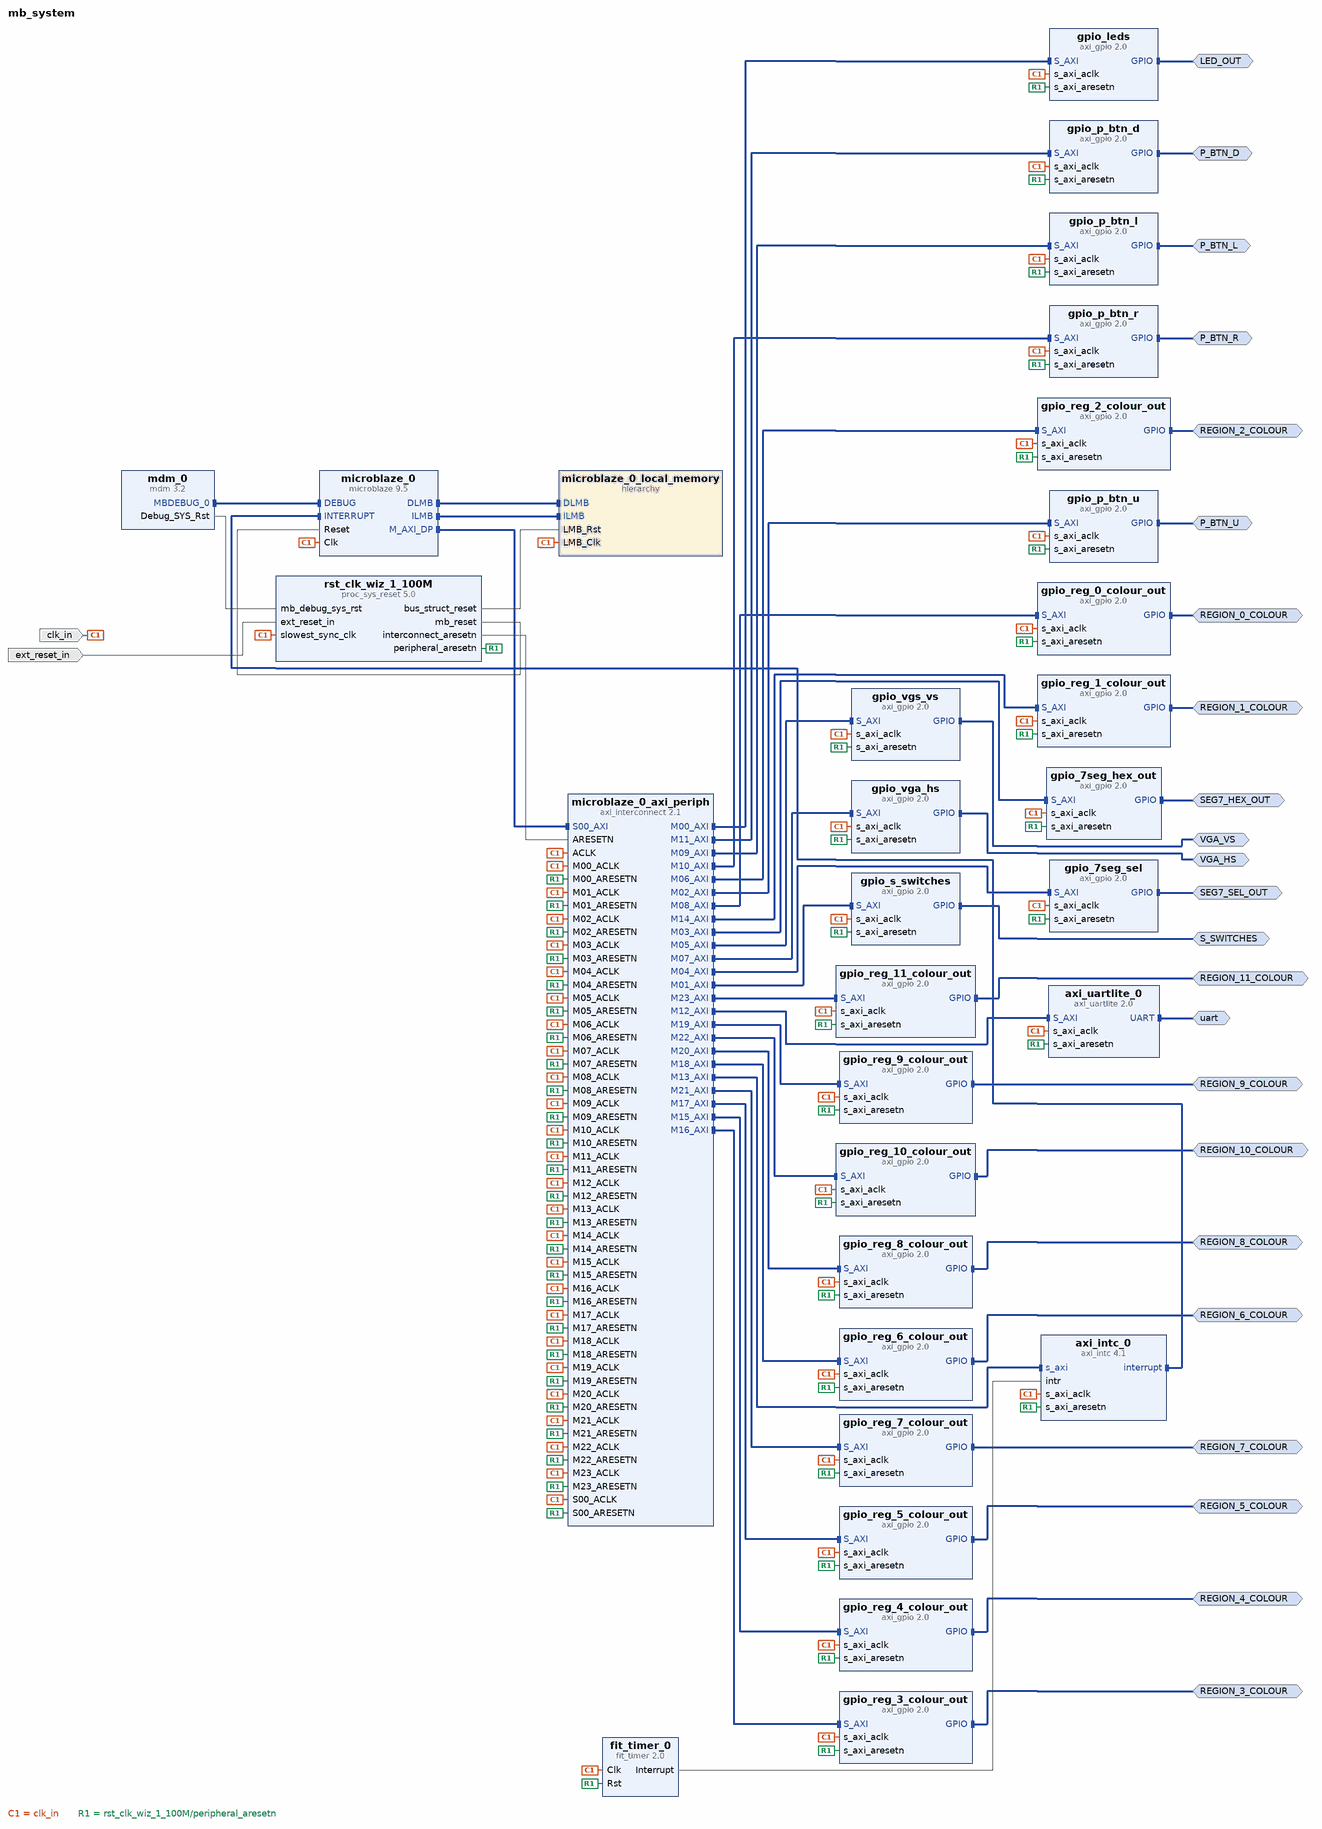
[diagram p0: block diagram of the top level]
# Vivado block design mb_system, Vivado 2015.2
create_bd_design mb_system

create_bd_intf_port -mode Master -vlnv xilinx.com:interface:gpio_rtl:1.0 LED_OUT
create_bd_intf_port -mode Master -vlnv xilinx.com:interface:gpio_rtl:1.0 S_SWITCHES
create_bd_intf_port -mode Master -vlnv xilinx.com:interface:gpio_rtl:1.0 P_BTN_U
create_bd_intf_port -mode Master -vlnv xilinx.com:interface:gpio_rtl:1.0 SEG7_HEX_OUT
create_bd_intf_port -mode Master -vlnv xilinx.com:interface:gpio_rtl:1.0 SEG7_SEL_OUT
create_bd_intf_port -mode Master -vlnv xilinx.com:interface:gpio_rtl:1.0 VGA_VS
create_bd_intf_port -mode Master -vlnv xilinx.com:interface:gpio_rtl:1.0 REGION_2_COLOUR
create_bd_intf_port -mode Master -vlnv xilinx.com:interface:gpio_rtl:1.0 VGA_HS
create_bd_intf_port -mode Master -vlnv xilinx.com:interface:gpio_rtl:1.0 REGION_0_COLOUR
create_bd_intf_port -mode Master -vlnv xilinx.com:interface:gpio_rtl:1.0 P_BTN_L
create_bd_intf_port -mode Master -vlnv xilinx.com:interface:gpio_rtl:1.0 P_BTN_R
create_bd_intf_port -mode Master -vlnv xilinx.com:interface:gpio_rtl:1.0 P_BTN_D
create_bd_intf_port -mode Master -vlnv xilinx.com:interface:uart_rtl:1.0 uart
create_bd_intf_port -mode Master -vlnv xilinx.com:interface:gpio_rtl:1.0 REGION_1_COLOUR
create_bd_intf_port -mode Master -vlnv xilinx.com:interface:gpio_rtl:1.0 REGION_3_COLOUR
create_bd_intf_port -mode Master -vlnv xilinx.com:interface:gpio_rtl:1.0 REGION_4_COLOUR
create_bd_intf_port -mode Master -vlnv xilinx.com:interface:gpio_rtl:1.0 REGION_5_COLOUR
create_bd_intf_port -mode Master -vlnv xilinx.com:interface:gpio_rtl:1.0 REGION_6_COLOUR
create_bd_intf_port -mode Master -vlnv xilinx.com:interface:gpio_rtl:1.0 REGION_9_COLOUR
create_bd_intf_port -mode Master -vlnv xilinx.com:interface:gpio_rtl:1.0 REGION_8_COLOUR
create_bd_intf_port -mode Master -vlnv xilinx.com:interface:gpio_rtl:1.0 REGION_7_COLOUR
create_bd_intf_port -mode Master -vlnv xilinx.com:interface:gpio_rtl:1.0 REGION_10_COLOUR
create_bd_intf_port -mode Master -vlnv xilinx.com:interface:gpio_rtl:1.0 REGION_11_COLOUR
create_bd_port -dir I -type clk clk_in
set_property -dict {CONFIG.FREQ_HZ 100000000 CONFIG.PHASE 0.000} [get_bd_ports clk_in]
create_bd_port -dir I -type rst ext_reset_in

create_bd_cell -type hier microblaze_0_local_memory
create_bd_cell -type ip -vlnv xilinx.com:ip:axi_gpio:2.0 gpio_leds
set_property -dict {CONFIG.C_GPIO_WIDTH 16 CONFIG.C_ALL_OUTPUTS 1} [get_bd_cells gpio_leds]
create_bd_cell -type ip -vlnv xilinx.com:ip:axi_intc:4.1 axi_intc_0
create_bd_cell -type ip -vlnv xilinx.com:ip:axi_uartlite:2.0 axi_uartlite_0
create_bd_cell -type ip -vlnv xilinx.com:ip:fit_timer:2.0 fit_timer_0
set_property -dict {CONFIG.C_NO_CLOCKS 400000} [get_bd_cells fit_timer_0]
create_bd_cell -type ip -vlnv xilinx.com:ip:axi_gpio:2.0 gpio_7seg_sel
set_property -dict {CONFIG.C_GPIO_WIDTH 4 CONFIG.C_DOUT_DEFAULT 0xFFFFFFFF CONFIG.C_ALL_OUTPUTS 1} [get_bd_cells gpio_7seg_sel]
create_bd_cell -type ip -vlnv xilinx.com:ip:axi_gpio:2.0 gpio_s_switches
set_property -dict {CONFIG.C_GPIO_WIDTH 16 CONFIG.C_ALL_INPUTS 1} [get_bd_cells gpio_s_switches]
create_bd_cell -type ip -vlnv xilinx.com:ip:axi_gpio:2.0 gpio_7seg_hex_out
set_property -dict {CONFIG.C_GPIO_WIDTH 8 CONFIG.C_ALL_OUTPUTS 1} [get_bd_cells gpio_7seg_hex_out]
create_bd_cell -type ip -vlnv xilinx.com:ip:axi_gpio:2.0 gpio_p_btn_l
set_property -dict {CONFIG.C_GPIO_WIDTH 1 CONFIG.C_ALL_INPUTS 1} [get_bd_cells gpio_p_btn_l]
create_bd_cell -type ip -vlnv xilinx.com:ip:axi_gpio:2.0 gpio_p_btn_r
set_property -dict {CONFIG.C_GPIO_WIDTH 1 CONFIG.C_ALL_INPUTS 1} [get_bd_cells gpio_p_btn_r]
create_bd_cell -type ip -vlnv xilinx.com:ip:axi_gpio:2.0 gpio_p_btn_d
set_property -dict {CONFIG.C_GPIO_WIDTH 1 CONFIG.C_ALL_INPUTS 1} [get_bd_cells gpio_p_btn_d]
create_bd_cell -type ip -vlnv xilinx.com:ip:axi_gpio:2.0 gpio_p_btn_u
set_property -dict {CONFIG.C_GPIO_WIDTH 1 CONFIG.C_ALL_INPUTS 1} [get_bd_cells gpio_p_btn_u]
create_bd_cell -type ip -vlnv xilinx.com:ip:axi_gpio:2.0 gpio_vgs_vs
set_property -dict {CONFIG.C_GPIO_WIDTH 1 CONFIG.C_ALL_INPUTS 0 CONFIG.C_ALL_OUTPUTS 1} [get_bd_cells gpio_vgs_vs]
create_bd_cell -type ip -vlnv xilinx.com:ip:axi_gpio:2.0 gpio_reg_2_colour_out
set_property -dict [list \
  CONFIG.C_GPIO_WIDTH 12 \
  CONFIG.C_ALL_INPUTS 0 \
  CONFIG.C_DOUT_DEFAULT 0xFFFFFFFF \
  CONFIG.C_ALL_OUTPUTS 1 \
] [get_bd_cells gpio_reg_2_colour_out]
create_bd_cell -type ip -vlnv xilinx.com:ip:axi_gpio:2.0 gpio_vga_hs
set_property -dict {CONFIG.C_GPIO_WIDTH 1 CONFIG.C_ALL_INPUTS 0 CONFIG.C_ALL_OUTPUTS 1} [get_bd_cells gpio_vga_hs]
create_bd_cell -type ip -vlnv xilinx.com:ip:axi_gpio:2.0 gpio_reg_0_colour_out
set_property -dict [list \
  CONFIG.C_GPIO_WIDTH 12 \
  CONFIG.C_ALL_INPUTS 0 \
  CONFIG.C_DOUT_DEFAULT 0xFFFFFFFF \
  CONFIG.C_ALL_OUTPUTS 1 \
] [get_bd_cells gpio_reg_0_colour_out]
create_bd_cell -type ip -vlnv xilinx.com:ip:mdm:3.2 mdm_0
create_bd_cell -type ip -vlnv xilinx.com:ip:microblaze:9.5 microblaze_0
set_property -dict [list \
  CONFIG.C_D_AXI 1 \
  CONFIG.C_D_LMB 1 \
  CONFIG.C_I_LMB 1 \
  CONFIG.C_DEBUG_ENABLED 1 \
  CONFIG.C_USE_ICACHE 0 \
  CONFIG.C_USE_DCACHE 0 \
] [get_bd_cells microblaze_0]
create_bd_cell -type ip -vlnv xilinx.com:ip:axi_interconnect:2.1 microblaze_0_axi_periph
set_property -dict {CONFIG.NUM_MI 24} [get_bd_cells microblaze_0_axi_periph]
create_bd_cell -type ip -vlnv xilinx.com:ip:proc_sys_reset:5.0 rst_clk_wiz_1_100M
create_bd_cell -type ip -vlnv xilinx.com:ip:axi_gpio:2.0 gpio_reg_1_colour_out
set_property -dict [list \
  CONFIG.C_GPIO_WIDTH 12 \
  CONFIG.C_ALL_INPUTS 0 \
  CONFIG.C_DOUT_DEFAULT 0xFFFFFFFF \
  CONFIG.C_ALL_OUTPUTS 1 \
] [get_bd_cells gpio_reg_1_colour_out]
create_bd_cell -type ip -vlnv xilinx.com:ip:axi_gpio:2.0 gpio_reg_4_colour_out
set_property -dict [list \
  CONFIG.C_GPIO_WIDTH 12 \
  CONFIG.C_ALL_INPUTS 0 \
  CONFIG.C_DOUT_DEFAULT 0xFFFFFFFF \
  CONFIG.C_ALL_OUTPUTS 1 \
] [get_bd_cells gpio_reg_4_colour_out]
create_bd_cell -type ip -vlnv xilinx.com:ip:axi_gpio:2.0 gpio_reg_3_colour_out
set_property -dict [list \
  CONFIG.C_GPIO_WIDTH 12 \
  CONFIG.C_ALL_INPUTS 0 \
  CONFIG.C_DOUT_DEFAULT 0xFFFFFFFF \
  CONFIG.C_ALL_OUTPUTS 1 \
] [get_bd_cells gpio_reg_3_colour_out]
create_bd_cell -type ip -vlnv xilinx.com:ip:axi_gpio:2.0 gpio_reg_5_colour_out
set_property -dict [list \
  CONFIG.C_GPIO_WIDTH 12 \
  CONFIG.C_ALL_INPUTS 0 \
  CONFIG.C_DOUT_DEFAULT 0xFFFFFFFF \
  CONFIG.C_ALL_OUTPUTS 1 \
] [get_bd_cells gpio_reg_5_colour_out]
create_bd_cell -type ip -vlnv xilinx.com:ip:axi_gpio:2.0 gpio_reg_6_colour_out
set_property -dict [list \
  CONFIG.C_GPIO_WIDTH 12 \
  CONFIG.C_ALL_INPUTS 0 \
  CONFIG.C_DOUT_DEFAULT 0xFFFFFFFF \
  CONFIG.C_ALL_OUTPUTS 1 \
] [get_bd_cells gpio_reg_6_colour_out]
create_bd_cell -type ip -vlnv xilinx.com:ip:axi_gpio:2.0 gpio_reg_9_colour_out
set_property -dict [list \
  CONFIG.C_GPIO_WIDTH 12 \
  CONFIG.C_ALL_INPUTS 0 \
  CONFIG.C_DOUT_DEFAULT 0xFFFFFFFF \
  CONFIG.C_ALL_OUTPUTS 1 \
] [get_bd_cells gpio_reg_9_colour_out]
create_bd_cell -type ip -vlnv xilinx.com:ip:axi_gpio:2.0 gpio_reg_8_colour_out
set_property -dict [list \
  CONFIG.C_GPIO_WIDTH 12 \
  CONFIG.C_ALL_INPUTS 0 \
  CONFIG.C_DOUT_DEFAULT 0xFFFFFFFF \
  CONFIG.C_ALL_OUTPUTS 1 \
] [get_bd_cells gpio_reg_8_colour_out]
create_bd_cell -type ip -vlnv xilinx.com:ip:axi_gpio:2.0 gpio_reg_7_colour_out
set_property -dict [list \
  CONFIG.C_GPIO_WIDTH 12 \
  CONFIG.C_ALL_INPUTS 0 \
  CONFIG.C_DOUT_DEFAULT 0xFFFFFFFF \
  CONFIG.C_ALL_OUTPUTS 1 \
] [get_bd_cells gpio_reg_7_colour_out]
create_bd_cell -type ip -vlnv xilinx.com:ip:axi_gpio:2.0 gpio_reg_10_colour_out
set_property -dict [list \
  CONFIG.C_GPIO_WIDTH 12 \
  CONFIG.C_ALL_INPUTS 0 \
  CONFIG.C_DOUT_DEFAULT 0xFFFFFFFF \
  CONFIG.C_ALL_OUTPUTS 1 \
] [get_bd_cells gpio_reg_10_colour_out]
create_bd_cell -type ip -vlnv xilinx.com:ip:axi_gpio:2.0 gpio_reg_11_colour_out
set_property -dict [list \
  CONFIG.C_GPIO_WIDTH 12 \
  CONFIG.C_ALL_INPUTS 0 \
  CONFIG.C_DOUT_DEFAULT 0xFFFFFFFF \
  CONFIG.C_ALL_OUTPUTS 1 \
] [get_bd_cells gpio_reg_11_colour_out]

# ---- hierarchy /microblaze_0_local_memory ----
current_bd_instance /microblaze_0_local_memory
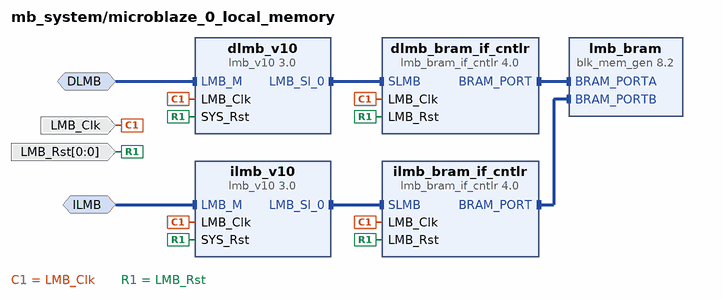
[diagram p1: block diagram inside /microblaze_0_local_memory]
create_bd_intf_pin -mode MirroredMaster -vlnv xilinx.com:interface:lmb_rtl:1.0 DLMB
create_bd_intf_pin -mode MirroredMaster -vlnv xilinx.com:interface:lmb_rtl:1.0 ILMB
create_bd_pin -dir I -type clk LMB_Clk
create_bd_pin -dir I -from 0 -to 0 -type rst LMB_Rst

create_bd_cell -type ip -vlnv xilinx.com:ip:lmb_bram_if_cntlr:4.0 dlmb_bram_if_cntlr
set_property -dict {CONFIG.C_ECC 0} [get_bd_cells dlmb_bram_if_cntlr]
create_bd_cell -type ip -vlnv xilinx.com:ip:lmb_v10:3.0 dlmb_v10
create_bd_cell -type ip -vlnv xilinx.com:ip:lmb_bram_if_cntlr:4.0 ilmb_bram_if_cntlr
set_property -dict {CONFIG.C_ECC 0} [get_bd_cells ilmb_bram_if_cntlr]
create_bd_cell -type ip -vlnv xilinx.com:ip:lmb_v10:3.0 ilmb_v10
create_bd_cell -type ip -vlnv xilinx.com:ip:blk_mem_gen:8.2 lmb_bram
set_property -dict {CONFIG.Memory_Type True_Dual_Port_RAM CONFIG.use_bram_block BRAM_Controller} [get_bd_cells lmb_bram]

# ---- connections ----

current_bd_instance /microblaze_0_local_memory
connect_bd_intf_net -intf_net microblaze_0_dlmb_bus [get_bd_intf_pins dlmb_v10/LMB_Sl_0] [get_bd_intf_pins dlmb_bram_if_cntlr/SLMB]
connect_bd_intf_net -intf_net microblaze_0_ilmb_bus [get_bd_intf_pins ilmb_v10/LMB_Sl_0] [get_bd_intf_pins ilmb_bram_if_cntlr/SLMB]
connect_bd_intf_net -intf_net microblaze_0_dlmb_cntlr [get_bd_intf_pins dlmb_bram_if_cntlr/BRAM_PORT] [get_bd_intf_pins lmb_bram/BRAM_PORTA]
connect_bd_intf_net -intf_net microblaze_0_ilmb_cntlr [get_bd_intf_pins ilmb_bram_if_cntlr/BRAM_PORT] [get_bd_intf_pins lmb_bram/BRAM_PORTB]
connect_bd_intf_net -intf_net microblaze_0_dlmb [get_bd_intf_pins DLMB] [get_bd_intf_pins dlmb_v10/LMB_M]
connect_bd_intf_net -intf_net microblaze_0_ilmb [get_bd_intf_pins ILMB] [get_bd_intf_pins ilmb_v10/LMB_M]
connect_bd_net -net microblaze_0_Clk [get_bd_pins LMB_Clk] \
  [get_bd_pins dlmb_bram_if_cntlr/LMB_Clk] [get_bd_pins dlmb_v10/LMB_Clk] [get_bd_pins ilmb_bram_if_cntlr/LMB_Clk] \
  [get_bd_pins ilmb_v10/LMB_Clk]
connect_bd_net -net microblaze_0_LMB_Rst [get_bd_pins LMB_Rst] \
  [get_bd_pins dlmb_bram_if_cntlr/LMB_Rst] [get_bd_pins dlmb_v10/SYS_Rst] [get_bd_pins ilmb_bram_if_cntlr/LMB_Rst] \
  [get_bd_pins ilmb_v10/SYS_Rst]

current_bd_instance /
connect_bd_intf_net [get_bd_intf_pins microblaze_0/DLMB] [get_bd_intf_pins microblaze_0_local_memory/DLMB]
connect_bd_intf_net [get_bd_intf_pins microblaze_0/ILMB] [get_bd_intf_pins microblaze_0_local_memory/ILMB]
connect_bd_intf_net [get_bd_intf_pins microblaze_0/M_AXI_DP] [get_bd_intf_pins microblaze_0_axi_periph/S00_AXI]
connect_bd_intf_net [get_bd_intf_pins microblaze_0_axi_periph/M00_AXI] [get_bd_intf_pins gpio_leds/S_AXI]
connect_bd_intf_net [get_bd_intf_pins microblaze_0_axi_periph/M01_AXI] [get_bd_intf_pins gpio_s_switches/S_AXI]
connect_bd_intf_net [get_bd_intf_pins microblaze_0_axi_periph/M02_AXI] [get_bd_intf_pins gpio_p_btn_u/S_AXI]
connect_bd_intf_net [get_bd_intf_pins microblaze_0_axi_periph/M03_AXI] [get_bd_intf_pins gpio_7seg_hex_out/S_AXI]
connect_bd_intf_net [get_bd_intf_pins microblaze_0_axi_periph/M04_AXI] [get_bd_intf_pins gpio_7seg_sel/S_AXI]
connect_bd_intf_net [get_bd_intf_pins microblaze_0_axi_periph/M05_AXI] [get_bd_intf_pins gpio_vgs_vs/S_AXI]
connect_bd_intf_net [get_bd_intf_pins microblaze_0_axi_periph/M06_AXI] [get_bd_intf_pins gpio_reg_2_colour_out/S_AXI]
connect_bd_intf_net [get_bd_intf_pins microblaze_0_axi_periph/M07_AXI] [get_bd_intf_pins gpio_vga_hs/S_AXI]
connect_bd_intf_net [get_bd_intf_pins microblaze_0_axi_periph/M08_AXI] [get_bd_intf_pins gpio_reg_0_colour_out/S_AXI]
connect_bd_intf_net [get_bd_intf_pins microblaze_0_axi_periph/M09_AXI] [get_bd_intf_pins gpio_p_btn_l/S_AXI]
connect_bd_intf_net [get_bd_intf_pins microblaze_0_axi_periph/M10_AXI] [get_bd_intf_pins gpio_p_btn_r/S_AXI]
connect_bd_intf_net [get_bd_intf_pins microblaze_0_axi_periph/M11_AXI] [get_bd_intf_pins gpio_p_btn_d/S_AXI]
connect_bd_intf_net [get_bd_intf_pins microblaze_0_axi_periph/M12_AXI] [get_bd_intf_pins axi_uartlite_0/S_AXI]
connect_bd_intf_net [get_bd_intf_pins mdm_0/MBDEBUG_0] [get_bd_intf_pins microblaze_0/DEBUG]
connect_bd_intf_net [get_bd_intf_pins axi_intc_0/interrupt] [get_bd_intf_pins microblaze_0/INTERRUPT]
connect_bd_intf_net [get_bd_intf_pins microblaze_0_axi_periph/M13_AXI] [get_bd_intf_pins axi_intc_0/s_axi]
connect_bd_intf_net [get_bd_intf_pins microblaze_0_axi_periph/M14_AXI] [get_bd_intf_pins gpio_reg_1_colour_out/S_AXI]
connect_bd_intf_net [get_bd_intf_pins microblaze_0_axi_periph/M15_AXI] [get_bd_intf_pins gpio_reg_4_colour_out/S_AXI]
connect_bd_intf_net [get_bd_intf_pins microblaze_0_axi_periph/M16_AXI] [get_bd_intf_pins gpio_reg_3_colour_out/S_AXI]
connect_bd_intf_net [get_bd_intf_pins microblaze_0_axi_periph/M17_AXI] [get_bd_intf_pins gpio_reg_5_colour_out/S_AXI]
connect_bd_intf_net [get_bd_intf_pins microblaze_0_axi_periph/M18_AXI] [get_bd_intf_pins gpio_reg_6_colour_out/S_AXI]
connect_bd_intf_net [get_bd_intf_pins microblaze_0_axi_periph/M19_AXI] [get_bd_intf_pins gpio_reg_9_colour_out/S_AXI]
connect_bd_intf_net [get_bd_intf_pins microblaze_0_axi_periph/M20_AXI] [get_bd_intf_pins gpio_reg_8_colour_out/S_AXI]
connect_bd_intf_net [get_bd_intf_pins microblaze_0_axi_periph/M21_AXI] [get_bd_intf_pins gpio_reg_7_colour_out/S_AXI]
connect_bd_intf_net [get_bd_intf_pins microblaze_0_axi_periph/M22_AXI] [get_bd_intf_pins gpio_reg_10_colour_out/S_AXI]
connect_bd_intf_net [get_bd_intf_pins microblaze_0_axi_periph/M23_AXI] [get_bd_intf_pins gpio_reg_11_colour_out/S_AXI]
connect_bd_intf_net [get_bd_intf_ports LED_OUT] [get_bd_intf_pins gpio_leds/GPIO]
connect_bd_intf_net [get_bd_intf_ports S_SWITCHES] [get_bd_intf_pins gpio_s_switches/GPIO]
connect_bd_intf_net -intf_net gpio_p_buttons_GPIO [get_bd_intf_ports P_BTN_U] [get_bd_intf_pins gpio_p_btn_u/GPIO]
connect_bd_intf_net -intf_net gpio_7seg_GPIO [get_bd_intf_ports SEG7_HEX_OUT] [get_bd_intf_pins gpio_7seg_hex_out/GPIO]
connect_bd_intf_net [get_bd_intf_ports SEG7_SEL_OUT] [get_bd_intf_pins gpio_7seg_sel/GPIO]
connect_bd_intf_net [get_bd_intf_ports VGA_VS] [get_bd_intf_pins gpio_vgs_vs/GPIO]
connect_bd_intf_net -intf_net gpio_vga_colour_out_GPIO [get_bd_intf_ports REGION_2_COLOUR] [get_bd_intf_pins gpio_reg_2_colour_out/GPIO]
connect_bd_intf_net [get_bd_intf_ports VGA_HS] [get_bd_intf_pins gpio_vga_hs/GPIO]
connect_bd_intf_net -intf_net gpio_vga_hs1_GPIO [get_bd_intf_ports REGION_0_COLOUR] [get_bd_intf_pins gpio_reg_0_colour_out/GPIO]
connect_bd_intf_net [get_bd_intf_ports P_BTN_L] [get_bd_intf_pins gpio_p_btn_l/GPIO]
connect_bd_intf_net [get_bd_intf_ports P_BTN_R] [get_bd_intf_pins gpio_p_btn_r/GPIO]
connect_bd_intf_net [get_bd_intf_ports P_BTN_D] [get_bd_intf_pins gpio_p_btn_d/GPIO]
connect_bd_intf_net [get_bd_intf_ports uart] [get_bd_intf_pins axi_uartlite_0/UART]
connect_bd_intf_net -intf_net gpio_vga_region1_GPIO [get_bd_intf_ports REGION_1_COLOUR] [get_bd_intf_pins gpio_reg_1_colour_out/GPIO]
connect_bd_intf_net -intf_net gpio_reg_1_colour_out2_GPIO [get_bd_intf_ports REGION_3_COLOUR] [get_bd_intf_pins gpio_reg_3_colour_out/GPIO]
connect_bd_intf_net -intf_net gpio_reg_1_colour_out1_GPIO [get_bd_intf_ports REGION_4_COLOUR] [get_bd_intf_pins gpio_reg_4_colour_out/GPIO]
connect_bd_intf_net -intf_net gpio_reg_1_colour_out3_GPIO [get_bd_intf_ports REGION_5_COLOUR] [get_bd_intf_pins gpio_reg_5_colour_out/GPIO]
connect_bd_intf_net -intf_net gpio_vga_region1_GPIO1 [get_bd_intf_ports REGION_6_COLOUR] [get_bd_intf_pins gpio_reg_6_colour_out/GPIO]
connect_bd_intf_net -intf_net gpio_reg_1_colour_out2_GPIO1 [get_bd_intf_ports REGION_9_COLOUR] [get_bd_intf_pins gpio_reg_9_colour_out/GPIO]
connect_bd_intf_net -intf_net gpio_reg_1_colour_out1_GPIO1 [get_bd_intf_ports REGION_8_COLOUR] [get_bd_intf_pins gpio_reg_8_colour_out/GPIO]
connect_bd_intf_net -intf_net gpio_reg_1_colour_out3_GPIO1 [get_bd_intf_ports REGION_7_COLOUR] [get_bd_intf_pins gpio_reg_7_colour_out/GPIO]
connect_bd_intf_net -intf_net gpio_reg_1_colour_out3_GPIO2 [get_bd_intf_ports REGION_10_COLOUR] [get_bd_intf_pins gpio_reg_10_colour_out/GPIO]
connect_bd_intf_net -intf_net gpio_reg_1_colour_out2_GPIO2 [get_bd_intf_ports REGION_11_COLOUR] [get_bd_intf_pins gpio_reg_11_colour_out/GPIO]
connect_bd_net -net microblaze_0_Clk [get_bd_ports clk_in] \
  [get_bd_pins gpio_leds/s_axi_aclk] [get_bd_pins axi_intc_0/s_axi_aclk] [get_bd_pins axi_uartlite_0/s_axi_aclk] \
  [get_bd_pins fit_timer_0/Clk] [get_bd_pins gpio_7seg_sel/s_axi_aclk] [get_bd_pins gpio_s_switches/s_axi_aclk] \
  [get_bd_pins gpio_7seg_hex_out/s_axi_aclk] [get_bd_pins gpio_p_btn_l/s_axi_aclk] [get_bd_pins gpio_p_btn_r/s_axi_aclk] \
  [get_bd_pins gpio_p_btn_d/s_axi_aclk] [get_bd_pins gpio_p_btn_u/s_axi_aclk] [get_bd_pins gpio_vgs_vs/s_axi_aclk] \
  [get_bd_pins gpio_reg_2_colour_out/s_axi_aclk] [get_bd_pins gpio_vga_hs/s_axi_aclk] \
  [get_bd_pins gpio_reg_0_colour_out/s_axi_aclk] [get_bd_pins microblaze_0/Clk] \
  [get_bd_pins rst_clk_wiz_1_100M/slowest_sync_clk] [get_bd_pins microblaze_0_local_memory/LMB_Clk] \
  [get_bd_pins microblaze_0_axi_periph/ACLK] [get_bd_pins microblaze_0_axi_periph/S00_ACLK] \
  [get_bd_pins microblaze_0_axi_periph/M00_ACLK] [get_bd_pins microblaze_0_axi_periph/M01_ACLK] \
  [get_bd_pins microblaze_0_axi_periph/M02_ACLK] [get_bd_pins microblaze_0_axi_periph/M03_ACLK] \
  [get_bd_pins microblaze_0_axi_periph/M04_ACLK] [get_bd_pins microblaze_0_axi_periph/M05_ACLK] \
  [get_bd_pins microblaze_0_axi_periph/M06_ACLK] [get_bd_pins microblaze_0_axi_periph/M07_ACLK] \
  [get_bd_pins microblaze_0_axi_periph/M08_ACLK] [get_bd_pins microblaze_0_axi_periph/M09_ACLK] \
  [get_bd_pins microblaze_0_axi_periph/M10_ACLK] [get_bd_pins microblaze_0_axi_periph/M11_ACLK] \
  [get_bd_pins microblaze_0_axi_periph/M12_ACLK] [get_bd_pins microblaze_0_axi_periph/M13_ACLK] \
  [get_bd_pins gpio_reg_1_colour_out/s_axi_aclk] [get_bd_pins microblaze_0_axi_periph/M14_ACLK] \
  [get_bd_pins gpio_reg_4_colour_out/s_axi_aclk] [get_bd_pins microblaze_0_axi_periph/M15_ACLK] \
  [get_bd_pins gpio_reg_3_colour_out/s_axi_aclk] [get_bd_pins microblaze_0_axi_periph/M16_ACLK] \
  [get_bd_pins gpio_reg_5_colour_out/s_axi_aclk] [get_bd_pins microblaze_0_axi_periph/M17_ACLK] \
  [get_bd_pins gpio_reg_6_colour_out/s_axi_aclk] [get_bd_pins microblaze_0_axi_periph/M18_ACLK] \
  [get_bd_pins gpio_reg_9_colour_out/s_axi_aclk] [get_bd_pins microblaze_0_axi_periph/M19_ACLK] \
  [get_bd_pins gpio_reg_8_colour_out/s_axi_aclk] [get_bd_pins microblaze_0_axi_periph/M20_ACLK] \
  [get_bd_pins gpio_reg_7_colour_out/s_axi_aclk] [get_bd_pins microblaze_0_axi_periph/M21_ACLK] \
  [get_bd_pins gpio_reg_10_colour_out/s_axi_aclk] [get_bd_pins microblaze_0_axi_periph/M22_ACLK] \
  [get_bd_pins gpio_reg_11_colour_out/s_axi_aclk] [get_bd_pins microblaze_0_axi_periph/M23_ACLK]
connect_bd_net [get_bd_pins rst_clk_wiz_1_100M/mb_reset] [get_bd_pins microblaze_0/Reset]
connect_bd_net [get_bd_pins rst_clk_wiz_1_100M/bus_struct_reset] [get_bd_pins microblaze_0_local_memory/LMB_Rst]
connect_bd_net [get_bd_pins rst_clk_wiz_1_100M/peripheral_aresetn] \
  [get_bd_pins gpio_leds/s_axi_aresetn] [get_bd_pins axi_intc_0/s_axi_aresetn] [get_bd_pins axi_uartlite_0/s_axi_aresetn] \
  [get_bd_pins fit_timer_0/Rst] [get_bd_pins gpio_7seg_sel/s_axi_aresetn] [get_bd_pins gpio_s_switches/s_axi_aresetn] \
  [get_bd_pins gpio_7seg_hex_out/s_axi_aresetn] [get_bd_pins gpio_p_btn_l/s_axi_aresetn] \
  [get_bd_pins gpio_p_btn_r/s_axi_aresetn] [get_bd_pins gpio_p_btn_d/s_axi_aresetn] [get_bd_pins gpio_p_btn_u/s_axi_aresetn] \
  [get_bd_pins gpio_vgs_vs/s_axi_aresetn] [get_bd_pins gpio_reg_2_colour_out/s_axi_aresetn] \
  [get_bd_pins gpio_vga_hs/s_axi_aresetn] [get_bd_pins gpio_reg_0_colour_out/s_axi_aresetn] \
  [get_bd_pins microblaze_0_axi_periph/S00_ARESETN] [get_bd_pins microblaze_0_axi_periph/M00_ARESETN] \
  [get_bd_pins microblaze_0_axi_periph/M01_ARESETN] [get_bd_pins microblaze_0_axi_periph/M02_ARESETN] \
  [get_bd_pins microblaze_0_axi_periph/M03_ARESETN] [get_bd_pins microblaze_0_axi_periph/M04_ARESETN] \
  [get_bd_pins microblaze_0_axi_periph/M05_ARESETN] [get_bd_pins microblaze_0_axi_periph/M06_ARESETN] \
  [get_bd_pins microblaze_0_axi_periph/M07_ARESETN] [get_bd_pins microblaze_0_axi_periph/M08_ARESETN] \
  [get_bd_pins microblaze_0_axi_periph/M09_ARESETN] [get_bd_pins microblaze_0_axi_periph/M10_ARESETN] \
  [get_bd_pins microblaze_0_axi_periph/M11_ARESETN] [get_bd_pins microblaze_0_axi_periph/M12_ARESETN] \
  [get_bd_pins microblaze_0_axi_periph/M13_ARESETN] [get_bd_pins gpio_reg_1_colour_out/s_axi_aresetn] \
  [get_bd_pins microblaze_0_axi_periph/M14_ARESETN] [get_bd_pins gpio_reg_4_colour_out/s_axi_aresetn] \
  [get_bd_pins microblaze_0_axi_periph/M15_ARESETN] [get_bd_pins gpio_reg_3_colour_out/s_axi_aresetn] \
  [get_bd_pins microblaze_0_axi_periph/M16_ARESETN] [get_bd_pins gpio_reg_5_colour_out/s_axi_aresetn] \
  [get_bd_pins microblaze_0_axi_periph/M17_ARESETN] [get_bd_pins gpio_reg_6_colour_out/s_axi_aresetn] \
  [get_bd_pins microblaze_0_axi_periph/M18_ARESETN] [get_bd_pins gpio_reg_9_colour_out/s_axi_aresetn] \
  [get_bd_pins microblaze_0_axi_periph/M19_ARESETN] [get_bd_pins gpio_reg_8_colour_out/s_axi_aresetn] \
  [get_bd_pins microblaze_0_axi_periph/M20_ARESETN] [get_bd_pins gpio_reg_7_colour_out/s_axi_aresetn] \
  [get_bd_pins microblaze_0_axi_periph/M21_ARESETN] [get_bd_pins gpio_reg_10_colour_out/s_axi_aresetn] \
  [get_bd_pins microblaze_0_axi_periph/M22_ARESETN] [get_bd_pins gpio_reg_11_colour_out/s_axi_aresetn] \
  [get_bd_pins microblaze_0_axi_periph/M23_ARESETN]
connect_bd_net [get_bd_pins rst_clk_wiz_1_100M/interconnect_aresetn] [get_bd_pins microblaze_0_axi_periph/ARESETN]
connect_bd_net [get_bd_pins mdm_0/Debug_SYS_Rst] [get_bd_pins rst_clk_wiz_1_100M/mb_debug_sys_rst]
connect_bd_net [get_bd_pins fit_timer_0/Interrupt] [get_bd_pins axi_intc_0/intr]
connect_bd_net [get_bd_ports ext_reset_in] [get_bd_pins rst_clk_wiz_1_100M/ext_reset_in]

# ---- address map ----
assign_bd_address -offset 0x00000000 -range 128K -target_address_space [get_bd_addr_spaces microblaze_0/Data] [get_bd_addr_segs microblaze_0_local_memory/dlmb_bram_if_cntlr/SLMB/Mem]
assign_bd_address -offset 0x40000000 -range 64K -target_address_space [get_bd_addr_spaces microblaze_0/Data] [get_bd_addr_segs gpio_leds/S_AXI/Reg]
assign_bd_address -offset 0x40010000 -range 64K -target_address_space [get_bd_addr_spaces microblaze_0/Data] [get_bd_addr_segs gpio_s_switches/S_AXI/Reg]
assign_bd_address -offset 0x40020000 -range 64K -target_address_space [get_bd_addr_spaces microblaze_0/Data] [get_bd_addr_segs gpio_p_btn_u/S_AXI/Reg]
assign_bd_address -offset 0x40030000 -range 64K -target_address_space [get_bd_addr_spaces microblaze_0/Data] [get_bd_addr_segs gpio_7seg_hex_out/S_AXI/Reg]
assign_bd_address -offset 0x40040000 -range 64K -target_address_space [get_bd_addr_spaces microblaze_0/Data] [get_bd_addr_segs gpio_7seg_sel/S_AXI/Reg]
assign_bd_address -offset 0x40050000 -range 64K -target_address_space [get_bd_addr_spaces microblaze_0/Data] [get_bd_addr_segs gpio_vgs_vs/S_AXI/Reg]
assign_bd_address -offset 0x40060000 -range 64K -target_address_space [get_bd_addr_spaces microblaze_0/Data] [get_bd_addr_segs gpio_reg_2_colour_out/S_AXI/Reg]
assign_bd_address -offset 0x40070000 -range 64K -target_address_space [get_bd_addr_spaces microblaze_0/Data] [get_bd_addr_segs gpio_vga_hs/S_AXI/Reg]
assign_bd_address -offset 0x40080000 -range 64K -target_address_space [get_bd_addr_spaces microblaze_0/Data] [get_bd_addr_segs gpio_reg_0_colour_out/S_AXI/Reg]
assign_bd_address -offset 0x40090000 -range 64K -target_address_space [get_bd_addr_spaces microblaze_0/Data] [get_bd_addr_segs gpio_p_btn_l/S_AXI/Reg]
assign_bd_address -offset 0x400A0000 -range 64K -target_address_space [get_bd_addr_spaces microblaze_0/Data] [get_bd_addr_segs gpio_p_btn_r/S_AXI/Reg]
assign_bd_address -offset 0x400B0000 -range 64K -target_address_space [get_bd_addr_spaces microblaze_0/Data] [get_bd_addr_segs gpio_p_btn_d/S_AXI/Reg]
assign_bd_address -offset 0x400C0000 -range 64K -target_address_space [get_bd_addr_spaces microblaze_0/Data] [get_bd_addr_segs gpio_reg_1_colour_out/S_AXI/Reg]
assign_bd_address -offset 0x400D0000 -range 64K -target_address_space [get_bd_addr_spaces microblaze_0/Data] [get_bd_addr_segs gpio_reg_4_colour_out/S_AXI/Reg]
assign_bd_address -offset 0x400E0000 -range 64K -target_address_space [get_bd_addr_spaces microblaze_0/Data] [get_bd_addr_segs gpio_reg_3_colour_out/S_AXI/Reg]
assign_bd_address -offset 0x400F0000 -range 64K -target_address_space [get_bd_addr_spaces microblaze_0/Data] [get_bd_addr_segs gpio_reg_5_colour_out/S_AXI/Reg]
assign_bd_address -offset 0x40100000 -range 64K -target_address_space [get_bd_addr_spaces microblaze_0/Data] [get_bd_addr_segs gpio_reg_6_colour_out/S_AXI/Reg]
assign_bd_address -offset 0x40110000 -range 64K -target_address_space [get_bd_addr_spaces microblaze_0/Data] [get_bd_addr_segs gpio_reg_9_colour_out/S_AXI/Reg]
assign_bd_address -offset 0x40120000 -range 64K -target_address_space [get_bd_addr_spaces microblaze_0/Data] [get_bd_addr_segs gpio_reg_8_colour_out/S_AXI/Reg]
assign_bd_address -offset 0x40130000 -range 64K -target_address_space [get_bd_addr_spaces microblaze_0/Data] [get_bd_addr_segs gpio_reg_7_colour_out/S_AXI/Reg]
assign_bd_address -offset 0x40140000 -range 64K -target_address_space [get_bd_addr_spaces microblaze_0/Data] [get_bd_addr_segs gpio_reg_10_colour_out/S_AXI/Reg]
assign_bd_address -offset 0x40150000 -range 64K -target_address_space [get_bd_addr_spaces microblaze_0/Data] [get_bd_addr_segs gpio_reg_11_colour_out/S_AXI/Reg]
assign_bd_address -offset 0x40600000 -range 64K -target_address_space [get_bd_addr_spaces microblaze_0/Data] [get_bd_addr_segs axi_uartlite_0/S_AXI/Reg]
assign_bd_address -offset 0x41200000 -range 64K -target_address_space [get_bd_addr_spaces microblaze_0/Data] [get_bd_addr_segs axi_intc_0/s_axi/Reg]
assign_bd_address -offset 0x00000000 -range 128K -target_address_space [get_bd_addr_spaces microblaze_0/Instruction] [get_bd_addr_segs microblaze_0_local_memory/ilmb_bram_if_cntlr/SLMB/Mem]

validate_bd_design
save_bd_design
